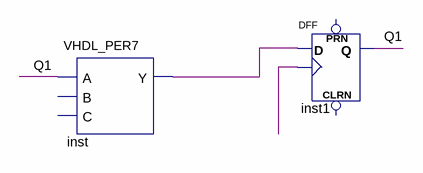
[diagram p0: schematic sheet]
// Quartus schematic Block1.bdf as structural Verilog: 2 symbols, 0 pins
module Block1 (
);

  wire inst_y, Q1, undriven;

  VHDL_PER7 inst (.A(Q1), .Y(inst_y));  // open: B, C
  DFF inst1 (.CLK(undriven), .D(inst_y), .Q(Q1));  // open: CLRN, PRN
endmodule
